# Altium schematic sheet Esquema-SMD_2025-10-18.schdoc
size 297 x 209 mm
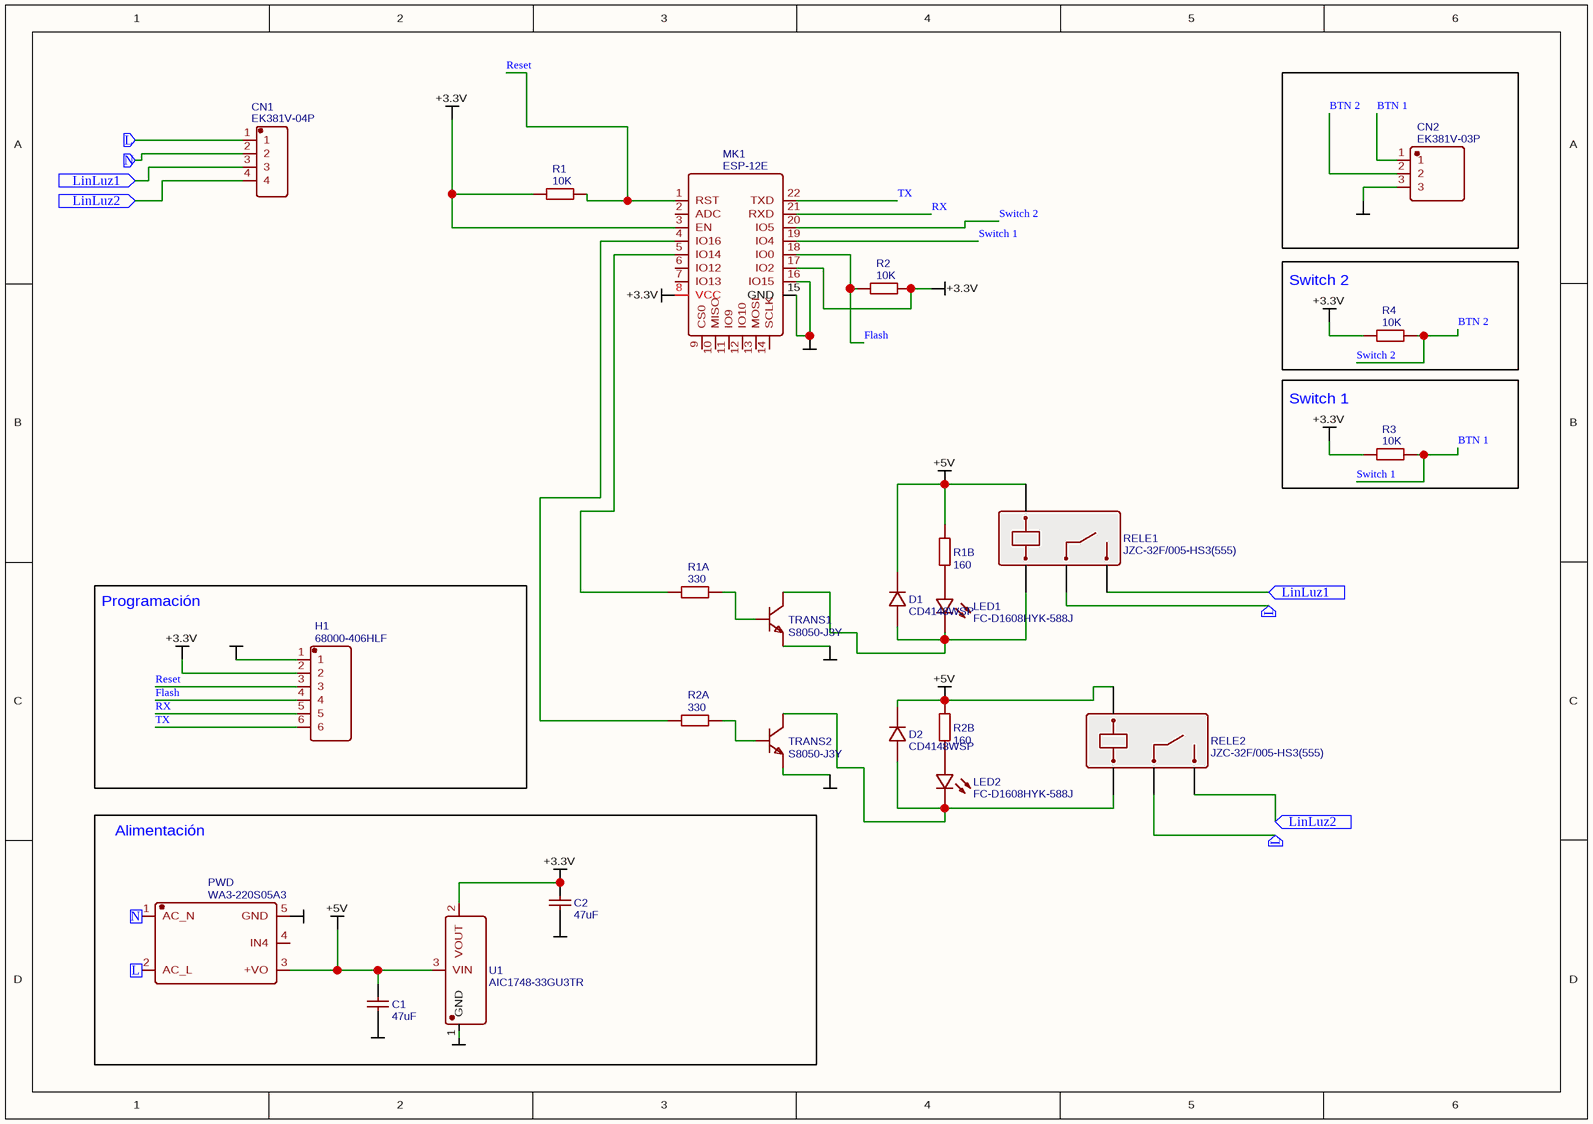
[diagram p0: Esquema-SMD_2025-10-18.schdoc]

## Parts
C1  47uF  [0805]
C2  47uF  [0805]
CN1  EK381V-04P  [DIP-15.24X7.4-1X4P-3.81MM]
CN2  EK381V-03P  [EK381V-03P]
D1  CD4148WSP  [D0805]
D2  CD4148WSP  [D0805]
H1  68000-406HLF  [68000-406HLF]
LED1  FC-D1608HYK-588J  [LED-0603]
LED2  FC-D1608HYK-588J  [LED-0603]
MK1  ESP-12E  [ESP-12E]
PWD  WA3-220S05A3  [WA3-220S05A3]
R1  10K  [0805]
R1A  330  [0805]
R1B  160  [0805]
R2  10K  [0805]
R2A  330  [0805]
R2B  160  [0805]
R3  10K  [0805]
R4  10K  [0805]
RELE1  JZC-32F/005-HS3(555)  [RELAY-HF_34]
RELE2  JZC-32F/005-HS3(555)  [RELAY-HF_34]
TRANS1  S8050-J3Y  [SOT-23]
TRANS2  S8050-J3Y  [SOT-23]
U1  AIC1748-33GU3TR  [SOT-23-3]

## Blocks framed on the sheet
Switch 2: R4
Switch 1: R3
Programación: H1
Alimentación: C1 C2 PWD U1

## Ports
L (in), LinLuz1 (in), LinLuz2 (in), N (in)

## Nets
+3.3V: C2.2 H1.2 MK1.3(EN) MK1.8(VCC) MK1.17(IO2) R1.1 R2.2 R3.1 R4.1 U1.2(VOUT)
+5V: C1.2 D1.2 D2.2 PWD.3(+VO) R1B.2 R2B.2 RELE1.2 RELE2.2 U1.3(VIN)
GND: C1.1 C2.1 CN2.3 H1.1 MK1.15(GND) MK1.16(IO15) PWD.5(GND) TRANS1.2(E) TRANS2.2(E) U1.1(GND)
BTN 1: CN2.1 MK1.19(IO4) R3.2  [also labelled Switch 1]
BTN 2: CN2.2 MK1.20(IO5) R4.2  [also labelled Switch 2]
Flash: H1.4 MK1.18(IO0) R2.1
L: CN1.1 PWD.2(AC_L) RELE1.4 RELE2.4 ; port L
LinLuz1: CN1.3 RELE1.3 ; port LinLuz1
LinLuz2: CN1.4 RELE2.3 ; port LinLuz2
N: CN1.2 PWD.1(AC_N) ; port N
Reset: H1.3 MK1.1(RST) R1.2
RX: H1.5 MK1.21(RXD)
TX: H1.6 MK1.22(TXD)
NetD1_1: D1.1 LED1.2(K) RELE1.1 TRANS1.3(C)
NetD2_1: D2.1 LED2.2(K) RELE2.1 TRANS2.3(C)
NetLED1_1: LED1.1(A) R1B.1
NetLED2_1: LED2.1(A) R2B.1
NetMK1_4: MK1.4(IO16) R2A.1
NetMK1_5: MK1.5(IO14) R1A.1
NetR1A_2: R1A.2 TRANS1.1(B)
NetR2A_2: R2A.2 TRANS2.1(B)

Not connected (* = marked no-connect by the designer): MK1 2(ADC) 6(IO12) 7(IO13) 9(CS0) 10(MISO) 11(IO9) 12(IO10) 13(MOSI) 14(SCLK); PWD 4(IN4)

## Library data of the parts
C1 C2 = 47uF: Manufacturer Part: CL21A476MQYNNNE; Manufacturer: SAMSUNG; nameAlias: Capacitance; Supplier: LCSC; Supplier Part: C16780; spicePre: C; spiceSymbolName: CL21A476MQYNNNE
CN1 = EK381V-04P: Manufacturer: Dinkle; Contributor: LCSC; Supplier: LCSC; Manufacturer Part: EK381V-04P; Supplier Part: C126133; spicePre: C
CN2 = EK381V-03P: Manufacturer: Dinkle; Contributor: LCSC; Supplier: LCSC; Supplier Part: C192646; Manufacturer Part: EK381V-03P; spicePre: C
D1 D2 = CD4148WSP: Manufacturer: SUP; Contributor: LCSC; Supplier Part: C53365; Supplier: LCSC; Manufacturer Part: CD4148WSP; spicePre: D
H1 = 68000-406HLF: Manufacturer: Amphenol ICC; Contributor: LCSC; Supplier: LCSC; Supplier Part: C178289; Manufacturer Part: 68000-406HLF; spicePre: H
LED1 LED2 = FC-D1608HYK-588J: Manufacturer: NATIONSTAR; Supplier: LCSC; Manufacturer Part: FC-D1608HYK-588J; Supplier Part: C84268; spicePre: L
MK1 = ESP-12E: Manufacturer: Ai-Thinker; Supplier: LCSC; Manufacturer Part: ESP-12E; Supplier Part: C89297; spicePre: M
PWD = WA3-220S05A3: Manufacturer: AIPULNION; Supplier: LCSC; Manufacturer Part: WA3-220S05A3; Supplier Part: C92997; spicePre: U
R1-R4 = 10K: Manufacturer: EVER OHMS; Manufacturer Part: QR0805J10KP05; nameAlias: Resistance (Ohms); Contributor: LCSC; Supplier: LCSC; Supplier Part: C149881; spicePre: R; spiceSymbolName: QR0805J10KP05
R1A R2A = 330: Manufacturer: KOA Speer Elec; Manufacturer Part: RK73H2ATTD3300F; nameAlias: Resistance (Ohms); Contributor: LCSC; Supplier: LCSC; Supplier Part: C276225; spicePre: R; spiceSymbolName: RK73H2ATTD3300F
R1B R2B = 160: Manufacturer: KOA Speer Elec; Manufacturer Part: RK73B2ATTD161J; nameAlias: Resistance (Ohms); Contributor: LCSC; Supplier: LCSC; Supplier Part: C316759; spicePre: R; spiceSymbolName: RK73B2ATTD161J
RELE1 RELE2 = JZC-32F/005-HS3(555): Manufacturer: HF; Supplier: LCSC; Manufacturer Part: JZC-32F/005-HS3(555); image: //image.lceda.cn/szlcsc/C9222.jpg; Supplier Part: C9222; spicePre: R
TRANS1 TRANS2 = S8050-J3Y: Manufacturer: (MDD) Jiangsu Yutai Elec; Contributor: LCSC; Supplier: LCSC; Supplier Part: C364312; Manufacturer Part: S8050-J3Y; spicePre: Q
U1 = AIC1748-33GU3TR: Manufacturer: Analog Integrations; Contributor: LCSC; Supplier: LCSC; Supplier Part: C238244; Manufacturer Part: AIC1748-33GU3TR; spicePre: U